# EAGLE schematic main_circuit (EAGLE 7.5.0)

## Sheet 1 of 3
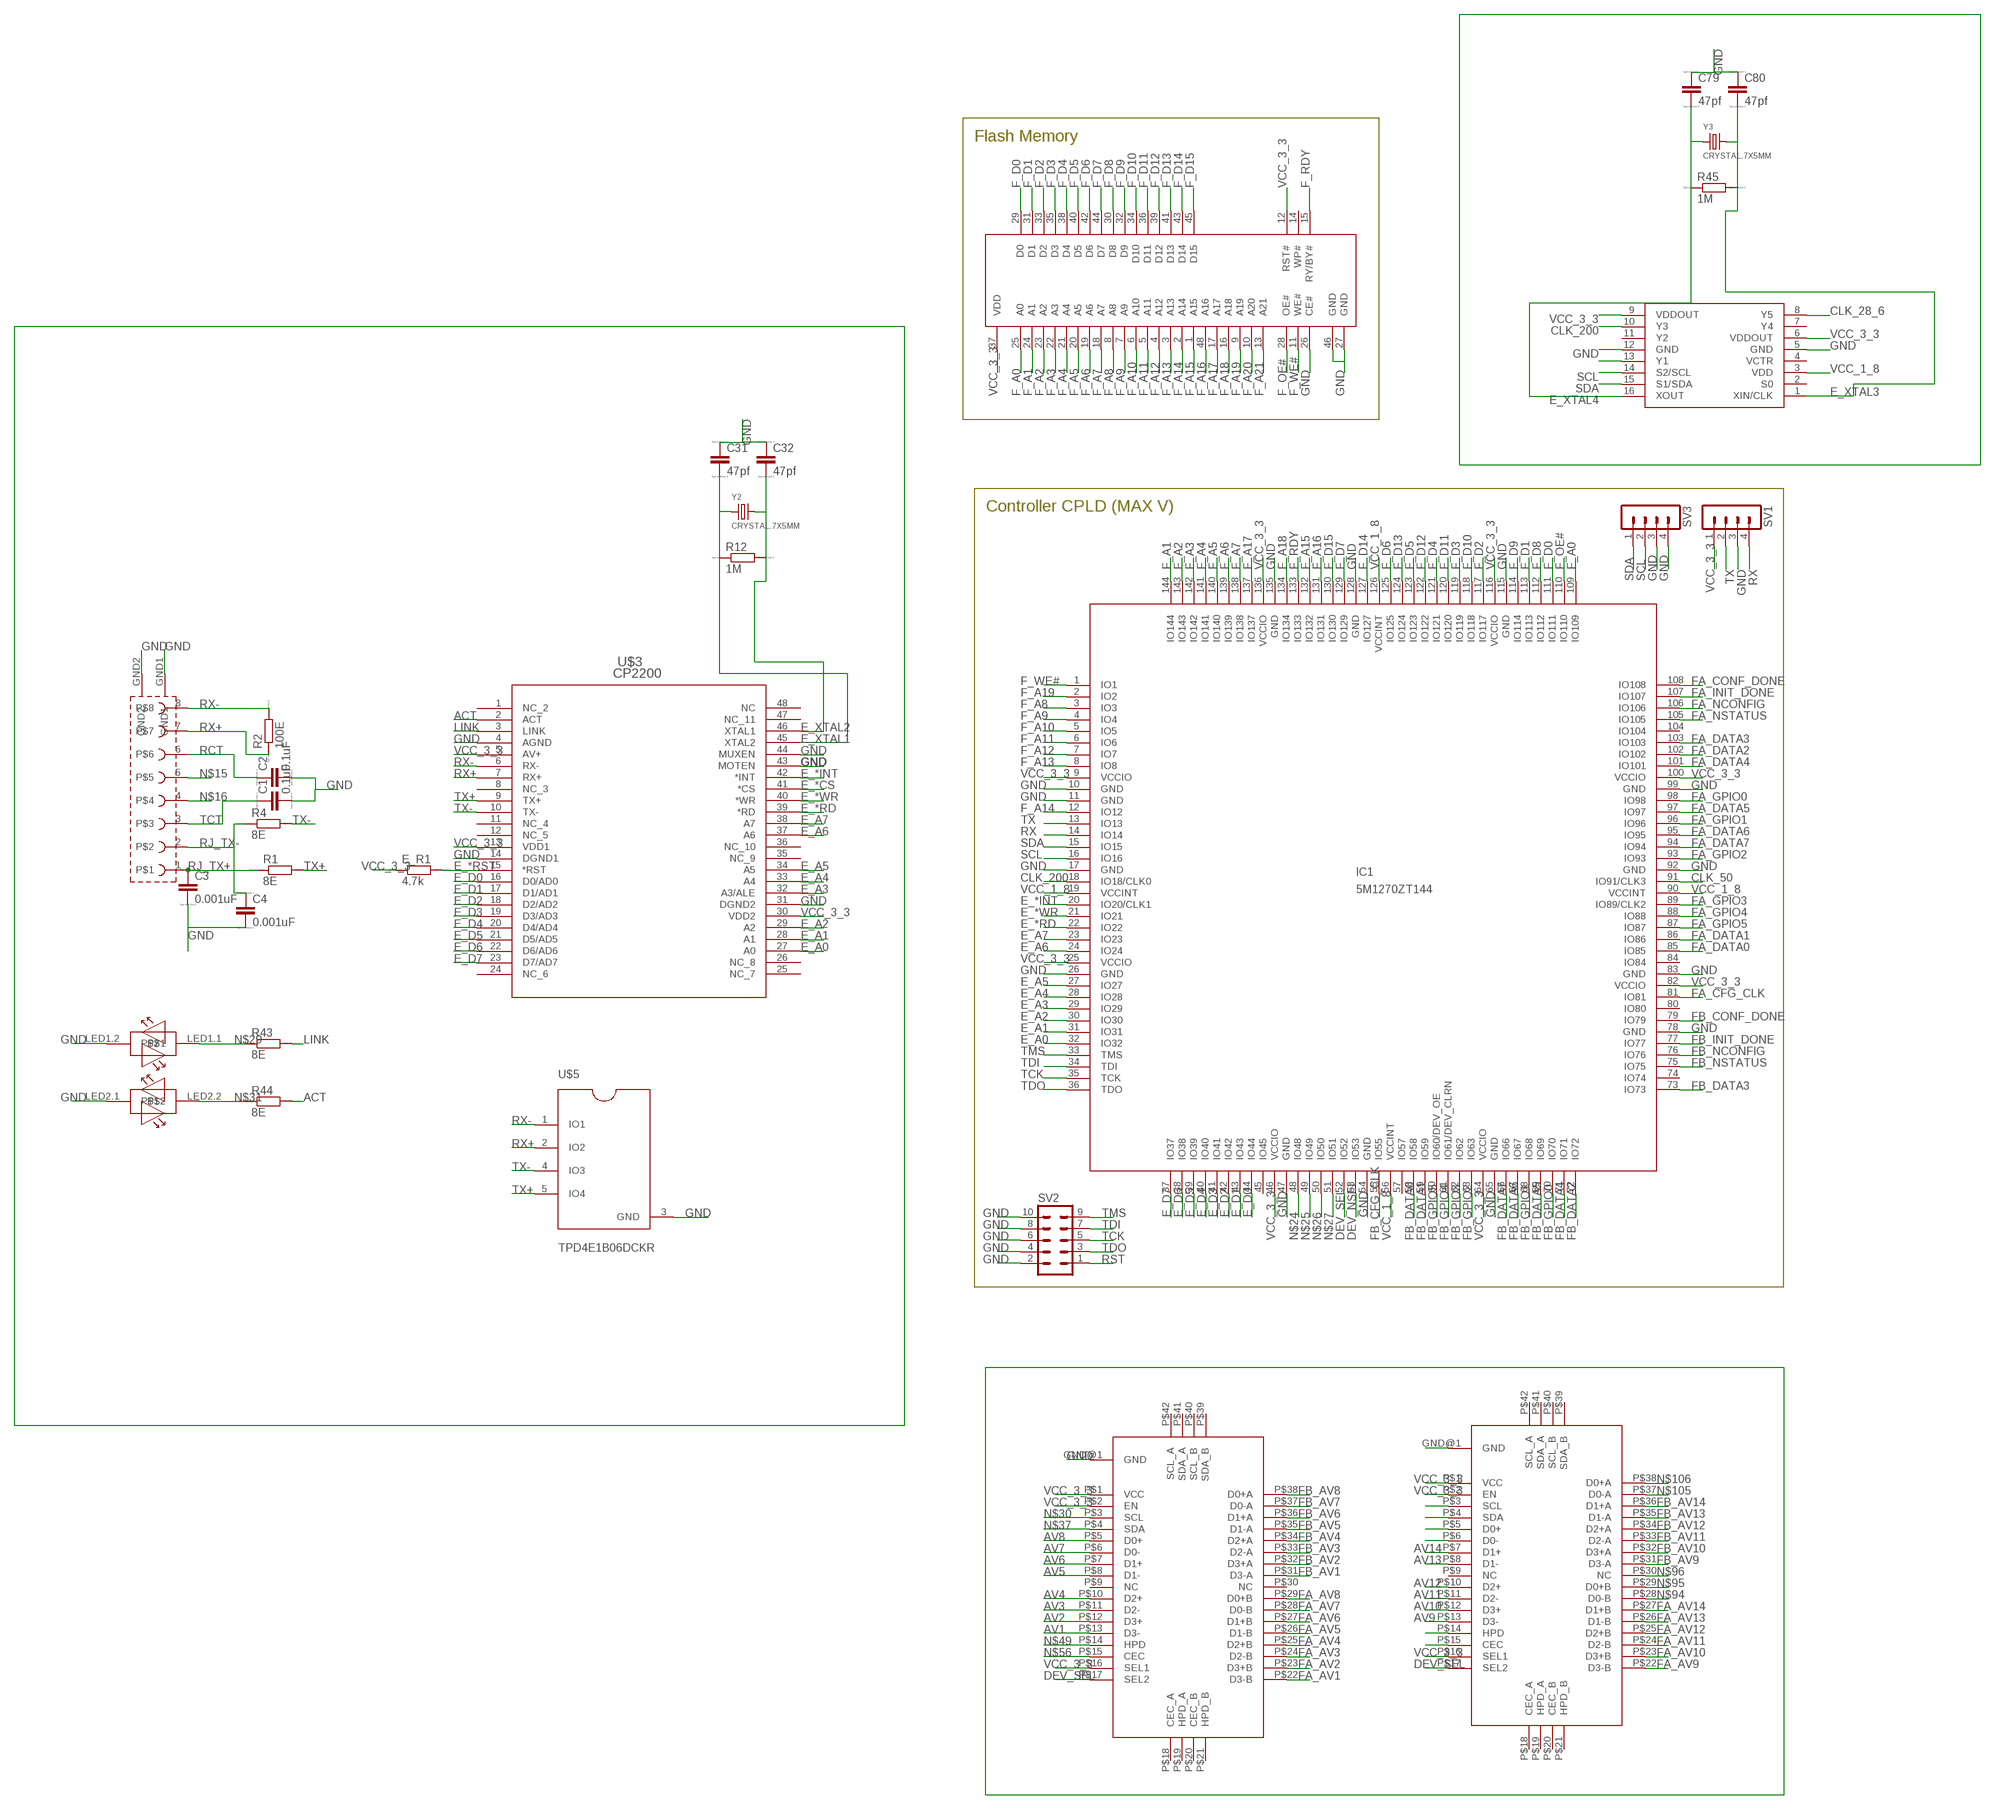
[diagram p0: schematic, sheet 1, part 1 of 3]
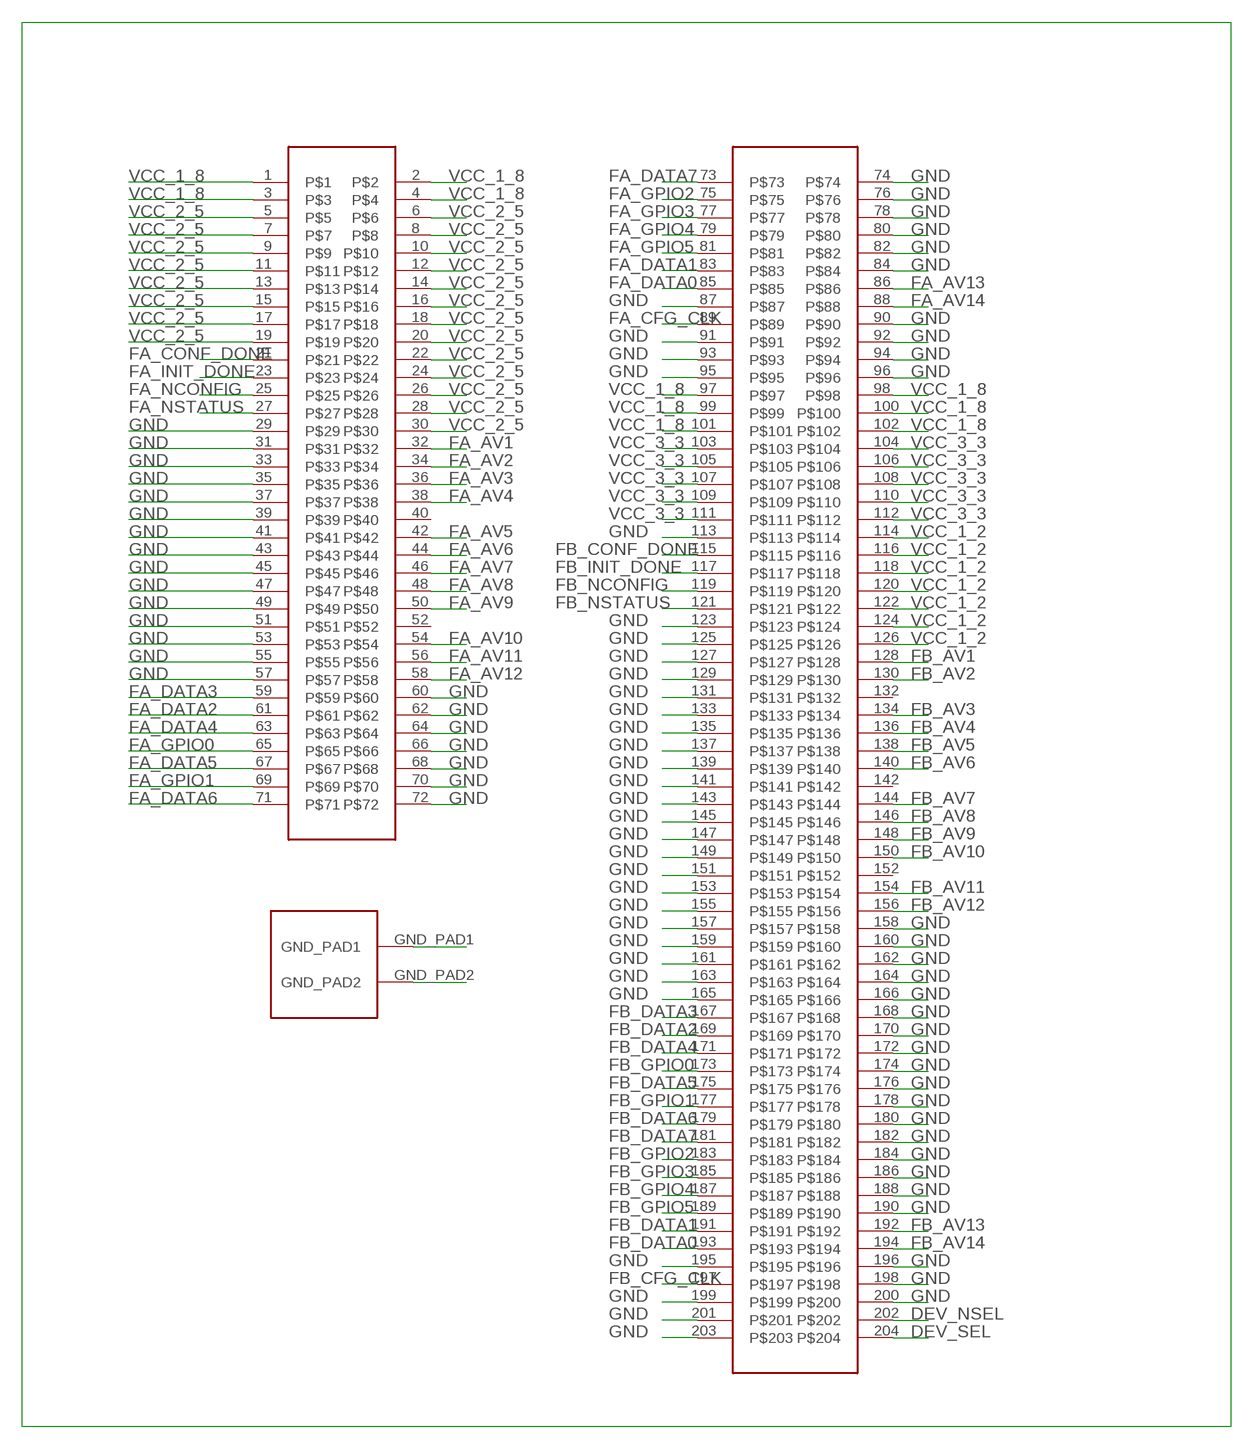
[diagram p1: schematic, sheet 1, part 2 of 3]
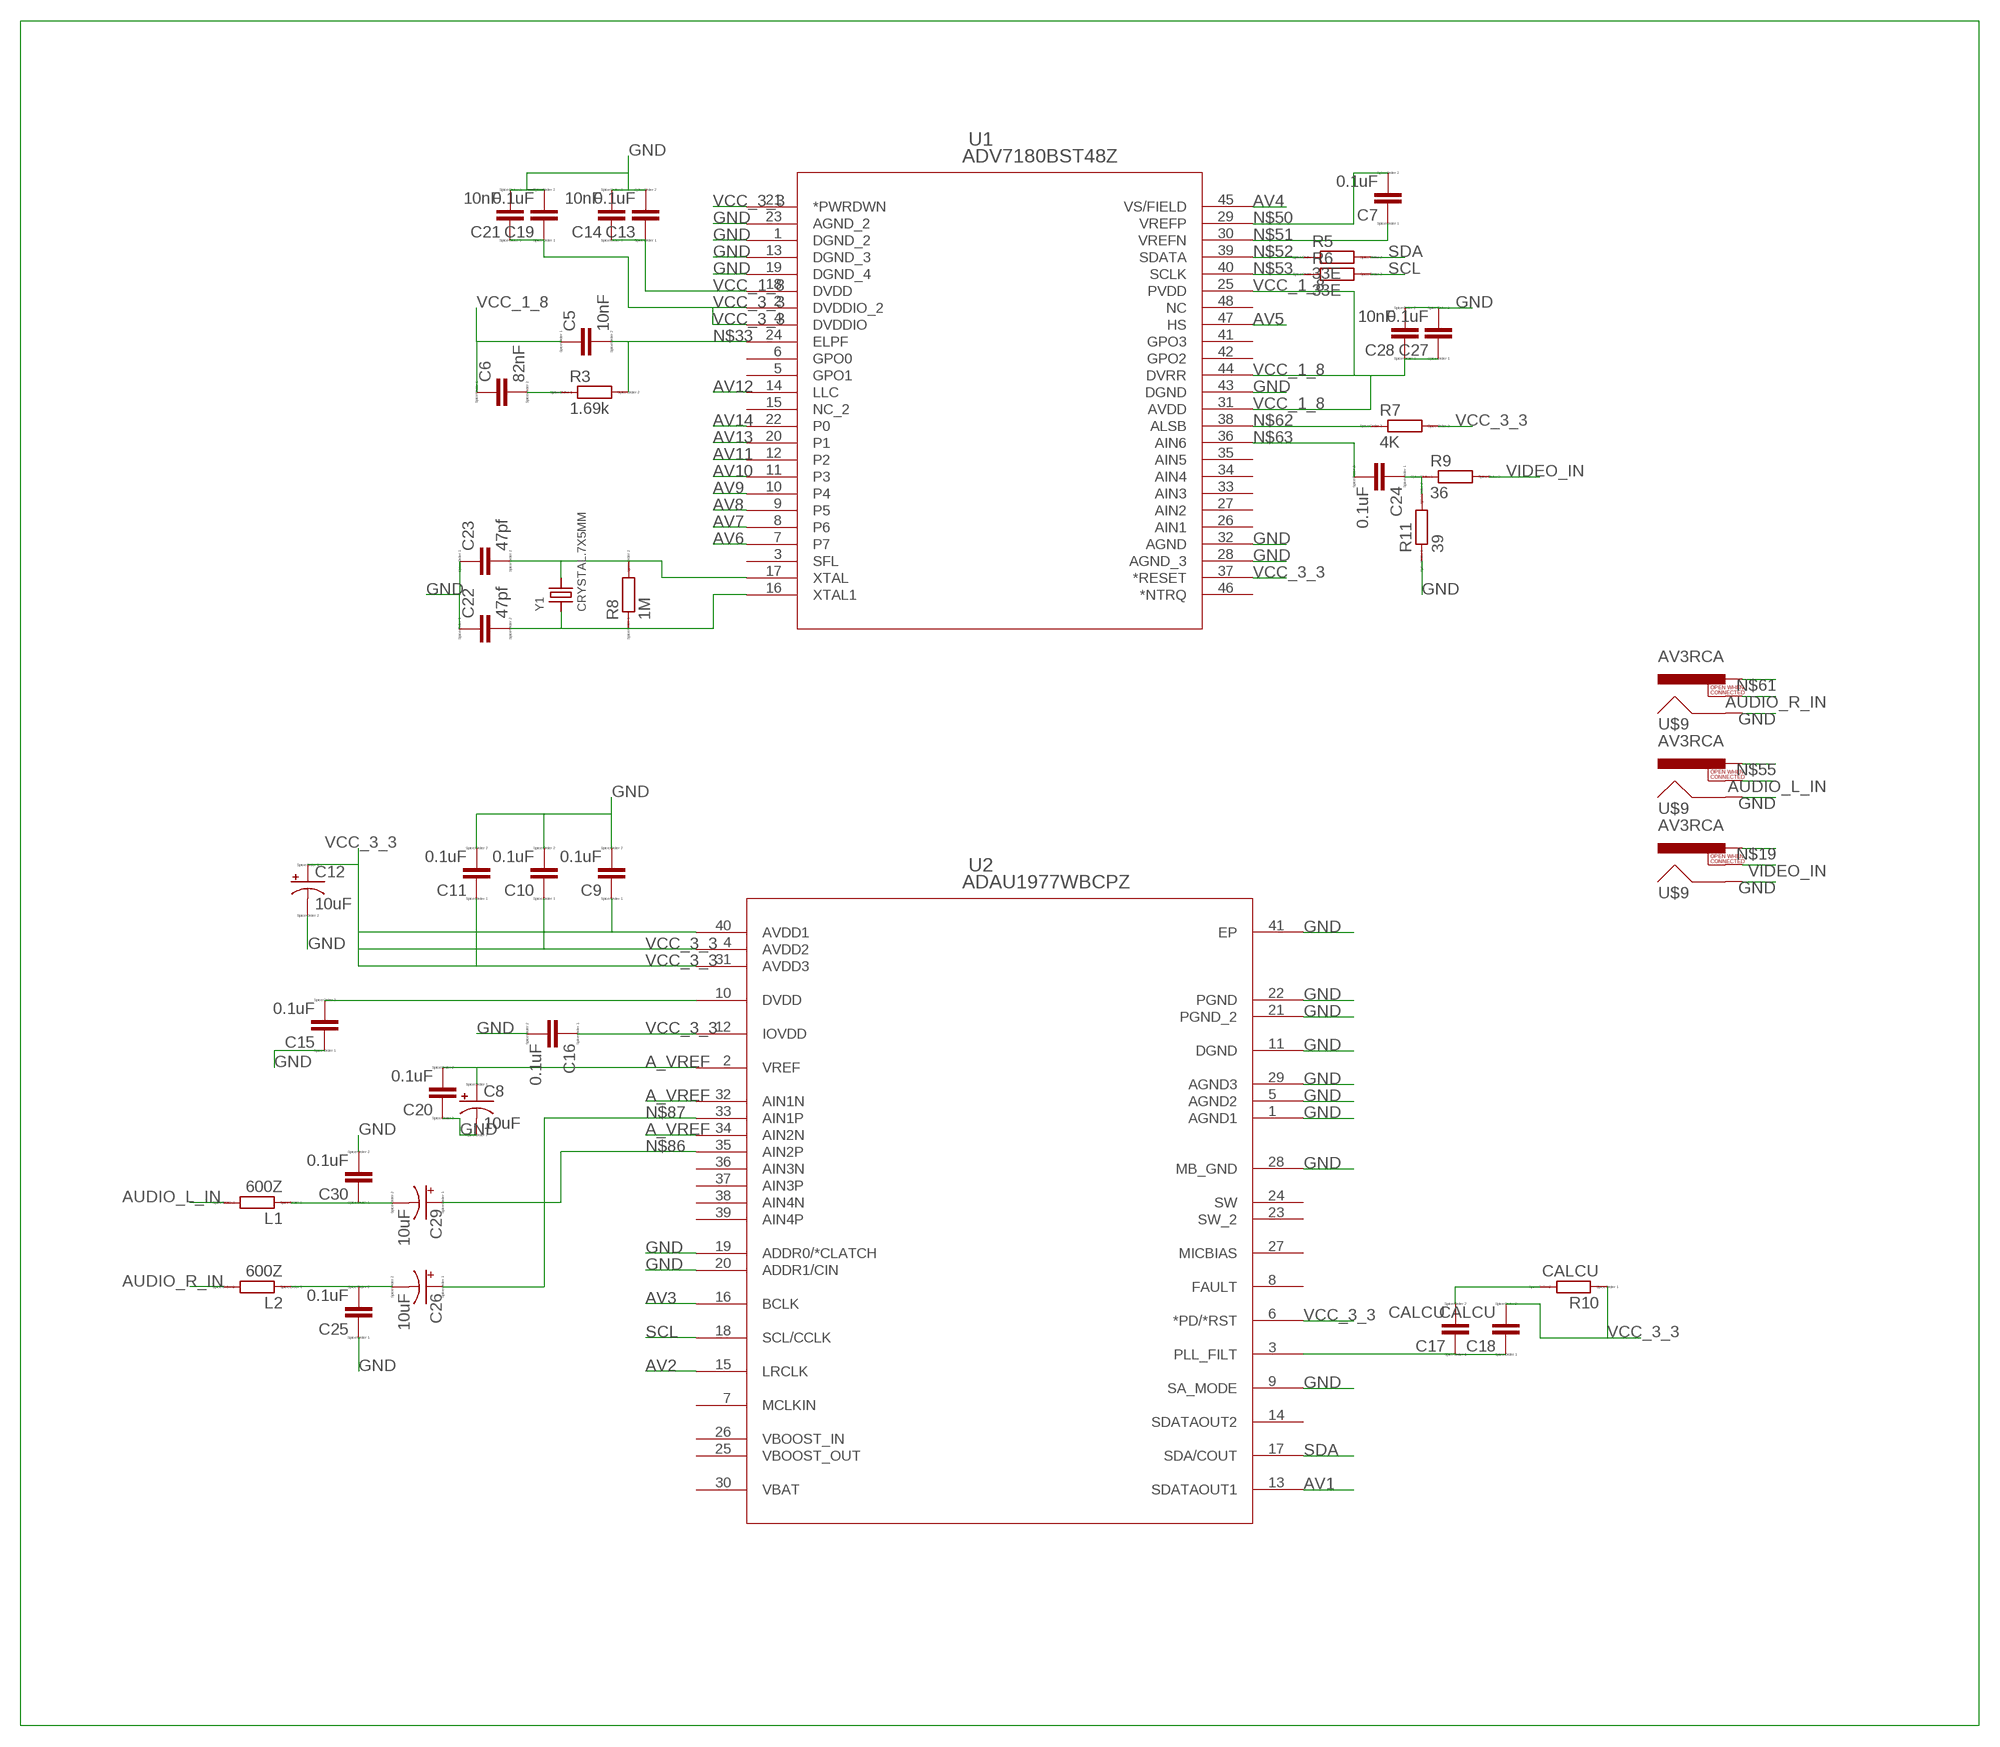
[diagram p2: schematic, sheet 1, part 3 of 3]

### Parts
C1  0.1uF  CC0402  [C0402]
C2  0.1uF  CC0402  [C0402]
C3  0.001uF  CC0402  [C0402]
C4  0.001uF  CC0402  [C0402]
C5  10nF  CC0603  [C0603]
C6  82nF  CC0603  [C0603]
C7  0.1uF  CC0603  [C0603]
C8  10uF  CPOL-USE2,5-6E  [E2,5-6E]
C9  0.1uF  CC0603  [C0603]
C10  0.1uF  CC0603  [C0603]
C11  0.1uF  CC0603  [C0603]
C12  10uF  CPOL-USE2,5-6E  [E2,5-6E]
C13  0.1uF  CC0603  [C0603]
C14  10nF  CC0603  [C0603]
C15  0.1uF  CC0603  [C0603]
C16  0.1uF  CC0603  [C0603]
C17  CALCU  CC0603  [C0603]
C18  CALCU  CC0603  [C0603]
C19  0.1uF  CC0603  [C0603]
C20  0.1uF  CC0603  [C0603]
C21  10nF  CC0603  [C0603]
C22  47pf  CC0603  [C0603]
C23  47pf  CC0603  [C0603]
C24  0.1uF  CC0603  [C0603]
C25  0.1uF  CC0603  [C0603]
C26  10uF  CPOL-USE2,5-6E  [E2,5-6E]
C27  0.1uF  CC0603  [C0603]
C28  10nF  CC0603  [C0603]
C29  10uF  CPOL-USE2,5-6E  [E2,5-6E]
C30  0.1uF  CC0603  [C0603]
C31  47pf  CC0603  [C0603]
C32  47pf  CC0603  [C0603]
C79  47pf  CC0603  [C0603]
C80  47pf  CC0603  [C0603]
E_R1  4.7k  RR0603  [R0603]
GND  TS3DV642  [R-PWQFN-N42]
IC1  5M1270ZT144  [TQFP144]
L1  600Z  RR0603  [R0603]
L2  600Z  RR0603  [R0603]
R1  8E  RR0402  [R0402]
R2  100E  RR0402  [R0402]
R3  1.69k  RR0603  [R0603]
R4  8E  RR0402  [R0402]
R5  33E  RR0603  [R0603]
R6  33E  RR0603  [R0603]
R7  4K  RR0603  [R0603]
R8  1M  RR0603  [R0603]
R9  36  RR0603  [R0603]
R10  CALCU  RR0603  [R0603]
R11  39  RR0603  [R0603]
R12  1M  RR0603  [R0603]
R43  8E  RR0402  [R0402]
R44  8E  RR0402  [R0402]
R45  1M  RR0603  [R0603]
SV1  MA04-1  [MA04-1]
SV2  MA05-2  [MA05-2]
SV3  MA04-1  [MA04-1]
U1  ADV7180BST48Z  [ST_48]
U2  ADAU1977WBCPZ  [CP_40_14]
U$1  SST39VF64  [TSOP48]
U$2  CDCE925  [R-PDSO-G16]
U$3  CP2200  CP2200-GQ  [QFP48-7X7-0P5MM]
U$4  SODIMM  [SODIMM_DDR3_CONN]
U$5  TPD4E1B06DCKR  [SC70-6]
U$6  MAGJACK  [MAGJACK]
U$8  TS3DV642  [R-PWQFN-N42]
U$9  AV3RCA  [AV3RCA]
Y1  CRYSTAL.7X5MM  [7X5MM]
Y2  CRYSTAL.7X5MM  [7X5MM]
Y3  CRYSTAL.7X5MM  [7X5MM]

### Nets
A_VREF: C8.+ C20.2 U2.2(VREF) U2.32(AIN1N) U2.34(AIN2N)
ACT: R44.2 U$3.2(ACT)
AUDIO_L_IN: L1.2 U$9.SWITCH
AUDIO_R_IN: L2.2 U$9.SWITCH1
AV1: GND.P$13(D3-) U2.13(SDATAOUT1)
AV2: GND.P$12(D3+) U2.15(LRCLK)
AV3: GND.P$11(D2-) U2.16(BCLK)
AV4: GND.P$10(D2+) U1.45(VS/FIELD)
AV5: GND.P$8(D1-) U1.47(HS)
AV6: GND.P$7(D1+) U1.7
AV7: GND.P$6(D0-) U1.8(P6)
AV8: GND.P$5(D0+) U1.9(P5)
AV9: U1.10(P4) U$8.P$13(D3-)
AV10: U1.11(P3) U$8.P$12(D3+)
AV11: U1.12(P2) U$8.P$11(D2-)
AV12: U1.14(LLC) U$8.P$10(D2+)
AV13: U1.20(P1) U$8.P$8(D1-)
AV14: U1.22(P0) U$8.P$7(D1+)
CLK_28_6: U$2.8(Y5)
CLK_50: IC1.91(IO91/CLK3) U$2.13(Y1)
CLK_200: IC1.18(IO18/CLK0) U$2.10(Y3)
DEV_NSEL: IC1.53(IO53) U$4.202
DEV_SEL: GND.P$17(SEL2) IC1.52(IO52) U$4.204 U$8.P$17(SEL2)
E_*CS: U$3.41(*CS)
E_*INT: IC1.20(IO20/CLK1) U$3.42(*INT)
E_*RD: IC1.22(IO22) U$3.39(*RD)
E_*RST: E_R1.2 U$3.15(*RST)
E_*WR: IC1.21(IO21) U$3.40(*WR)
E_A0: IC1.32(IO32) U$3.27(A0)
E_A1: IC1.31(IO31) U$3.28(A1)
E_A2: IC1.30(IO30) U$3.29(A2)
E_A3: IC1.29(IO29) U$3.32(A3/ALE)
E_A4: IC1.28(IO28) U$3.33(A4)
E_A5: IC1.27(IO27) U$3.34(A5)
E_A6: IC1.24(IO24) U$3.37(A6)
E_A7: IC1.23(IO23) U$3.38(A7)
E_D0: IC1.44(IO44) U$3.16(D0/AD0)
E_D1: IC1.43(IO43) U$3.17(D1/AD1)
E_D2: IC1.42(IO42) U$3.18(D2/AD2)
E_D3: IC1.41(IO41) U$3.19(D3/AD3)
E_D4: IC1.40(IO40) U$3.20(D4/AD4)
E_D5: IC1.39(IO39) U$3.21(D5/AD5)
E_D6: IC1.38(IO38) U$3.22(D6/AD6)
E_D7: IC1.37(IO37) U$3.23(D7/AD7)
E_XTAL1: C31.2 R12.1 U$3.45(XTAL2) Y2.1
E_XTAL2: C32.2 R12.2 U$3.46(XTAL1) Y2.3
E_XTAL3: C80.2 R45.2 U$2.1(XIN/CLK) Y3.3
E_XTAL4: C79.2 R45.1 U$2.16(XOUT) Y3.1
F_A0: IC1.109(IO109) U$1.25(A0)
F_A1: IC1.144(IO144) U$1.24(A1)
F_A2: IC1.143(IO143) U$1.23(A2)
F_A3: IC1.142(IO142) U$1.22(A3)
F_A4: IC1.141(IO141) U$1.21(A4)
F_A5: IC1.140(IO140) U$1.20(A5)
F_A6: IC1.139(IO139) U$1.19(A6)
F_A7: IC1.138(IO138) U$1.18(A7)
F_A8: IC1.3(IO3) U$1.8(A8)
F_A9: IC1.4(IO4) U$1.7(A9)
F_A10: IC1.5(IO5) U$1.6(A10)
F_A11: IC1.6(IO6) U$1.5(A11)
F_A12: IC1.7(IO7) U$1.4(A12)
F_A13: IC1.8(IO8) U$1.3(A13)
F_A14: IC1.12(IO12) U$1.2(A14)
F_A15: IC1.132(IO132) U$1.1(A15)
F_A16: IC1.131(IO131) U$1.48(A16)
F_A17: IC1.137(IO137) U$1.17(A17)
F_A18: IC1.134(IO134) U$1.16(A18)
F_A19: IC1.2(IO2) U$1.9(A19)
F_A20: U$1.10(A20)
F_A21: U$1.13(A21)
F_D0: IC1.111(IO111) U$1.29(D0)
F_D1: IC1.113(IO113) U$1.31(D1)
F_D2: IC1.117(IO117) U$1.33(D2)
F_D3: IC1.119(IO119) U$1.35(D3)
F_D4: IC1.121(IO121) U$1.38(D4)
F_D5: IC1.123(IO123) U$1.40(D5)
F_D6: IC1.125(IO125) U$1.42(D6)
F_D7: IC1.129(IO129) U$1.44(D7)
F_D8: IC1.112(IO112) U$1.30(D8)
F_D9: IC1.114(IO114) U$1.32(D9)
F_D10: IC1.118(IO118) U$1.34(D10)
F_D11: IC1.120(IO120) U$1.36(D11)
F_D12: IC1.122(IO122) U$1.39(D12)
F_D13: IC1.124(IO124) U$1.41(D13)
F_D14: IC1.127(IO127) U$1.43(D14)
F_D15: IC1.130(IO130) U$1.45(D15)
F_OE#: IC1.110(IO110) U$1.28(OE#)
F_RDY: IC1.133(IO133) U$1.15(RY/BY#)
F_WE#: IC1.1(IO1) U$1.11(WE#)
FA_AV1: GND.P$22(D3-B) U$4.32
FA_AV2: GND.P$23(D3+B) U$4.34
FA_AV3: GND.P$24(D2-B) U$4.36
FA_AV4: GND.P$25(D2+B) U$4.38
FA_AV5: GND.P$26(D1-B) U$4.42
FA_AV6: GND.P$27(D1+B) U$4.44
FA_AV7: GND.P$28(D0-B) U$4.46
FA_AV8: GND.P$29(D0+B) U$4.48
FA_AV9: U$4.50 U$8.P$22(D3-B)
FA_AV10: U$4.54 U$8.P$23(D3+B)
FA_AV11: U$4.56 U$8.P$24(D2-B)
FA_AV12: U$4.58 U$8.P$25(D2+B)
FA_AV13: U$4.86 U$8.P$26(D1-B)
FA_AV14: U$4.88 U$8.P$27(D1+B)
FA_CFG_CLK: IC1.81(IO81) U$4.89
FA_CONF_DONE: IC1.108(IO108) U$4.21
FA_DATA0: IC1.85(IO85) U$4.85
FA_DATA1: IC1.86(IO86) U$4.83
FA_DATA2: IC1.102(IO102) U$4.61
FA_DATA3: IC1.103(IO103) U$4.59
FA_DATA4: IC1.101(IO101) U$4.63
FA_DATA5: IC1.97(IO97) U$4.67
FA_DATA6: IC1.95(IO95) U$4.71
FA_DATA7: IC1.94(IO94) U$4.73
FA_GPIO0: IC1.98(IO98) U$4.65
FA_GPIO1: IC1.96(IO96) U$4.69
FA_GPIO2: IC1.93(IO93) U$4.75
FA_GPIO3: IC1.89(IO89/CLK2) U$4.77
FA_GPIO4: IC1.88(IO88) U$4.79
FA_GPIO5: IC1.87(IO87) U$4.81
FA_INIT_DONE: IC1.107(IO107) U$4.23
FA_NCONFIG: IC1.106(IO106) U$4.25
FA_NSTATUS: IC1.105(IO105) U$4.27
FB_AV1: GND.P$31(D3-A) U$4.128
FB_AV2: GND.P$32(D3+A) U$4.130
FB_AV3: GND.P$33(D2-A) U$4.134
FB_AV4: GND.P$34(D2+A) U$4.136
FB_AV5: GND.P$35(D1-A) U$4.138
FB_AV6: GND.P$36(D1+A) U$4.140
FB_AV7: GND.P$37(D0-A) U$4.144
FB_AV8: GND.P$38(D0+A) U$4.146
FB_AV9: U$4.148 U$8.P$31(D3-A)
FB_AV10: U$4.150 U$8.P$32(D3+A)
FB_AV11: U$4.154 U$8.P$33(D2-A)
FB_AV12: U$4.156 U$8.P$34(D2+A)
FB_AV13: U$4.192 U$8.P$35(D1-A)
FB_AV14: U$4.194 U$8.P$36(D1+A)
FB_CFG_CLK: IC1.55(IO55) U$4.197
FB_CONF_DONE: IC1.79(IO79) U$4.115
FB_DATA0: IC1.58(IO58) U$4.193
FB_DATA1: IC1.59(IO59) U$4.191
FB_DATA2: IC1.72(IO72) U$4.169
FB_DATA3: IC1.73(IO73) U$4.167
FB_DATA4: IC1.71(IO71) U$4.171
FB_DATA5: IC1.69(IO69) U$4.175
FB_DATA6: IC1.67(IO67) U$4.179
FB_DATA7: IC1.66(IO66) U$4.181
FB_GPIO0: IC1.70(IO70) U$4.173
FB_GPIO1: IC1.68(IO68) U$4.177
FB_GPIO2: IC1.63(IO63) U$4.183
FB_GPIO3: IC1.62(IO62) U$4.185
FB_GPIO4: IC1.61(IO61/DEV_CLRN) U$4.187
FB_GPIO5: IC1.60(IO60/DEV_OE) U$4.189
FB_INIT_DONE: IC1.77(IO77) U$4.117
FB_NCONFIG: IC1.76(IO76) U$4.119
FB_NSTATUS: IC1.75(IO75) U$4.121
GND: C1.2 C2.2 C3.2 C4.2 C8.- C9.2 C10.2 C11.2 C12.- C13.2 C14.2 C15.1 C16.2 C19.2 C20.1 C21.2 C22.1 C23.1 C25.1 C27.2 C28.2 C30.2 C31.1 C32.1 C79.1 C80.1 GND.GND@1(GND) IC1.10(GND) IC1.11(GND) IC1.17(GND) IC1.26(GND) IC1.47(GND) IC1.54(GND) IC1.65(GND) IC1.78(GND) IC1.83(GND) IC1.92(GND) IC1.99(GND) IC1.115(GND) IC1.128(GND) IC1.135(GND) R11.1 SV1.3 SV2.2 SV2.4 SV2.6 SV2.8 SV2.10 SV3.3 SV3.4 U1.1(DGND_2) U1.13(DGND_3) U1.19(DGND_4) U1.23(AGND_2) U1.28(AGND_3) U1.32(AGND) U1.43(DGND) U2.1(AGND1) U2.5(AGND2) U2.9(SA_MODE) U2.11(DGND) U2.19(ADDR0/*CLATCH) U2.20(ADDR1/CIN) U2.21(PGND_2) U2.22(PGND) U2.28(MB_GND) U2.29(AGND3) U2.41(EP) U$1.26(CE#) U$1.27(GND) U$1.46(GND) U$2.5(GND) U$2.12(GND) U$3.4(AGND) U$3.14(DGND1) U$3.31(DGND2) U$3.43(MOTEN) U$3.44(MUXEN) U$4.29 U$4.31 U$4.33 U$4.35 U$4.37 U$4.39 U$4.41 U$4.43 U$4.45 U$4.47 U$4.49 U$4.51 U$4.53 U$4.55 U$4.57 U$4.60 U$4.62 U$4.64 U$4.66 U$4.68 U$4.70 U$4.72 U$4.74 U$4.76 U$4.78 U$4.80 U$4.82 U$4.84 U$4.87 U$4.90 U$4.91 U$4.92 U$4.93 U$4.94 U$4.95 U$4.96 U$4.113 U$4.123 U$4.125 U$4.127 U$4.129 U$4.131 U$4.133 U$4.135 U$4.137 U$4.139 U$4.141 U$4.143 U$4.145 U$4.147 U$4.149 U$4.151 U$4.153 U$4.155 U$4.157 U$4.158 U$4.159 U$4.160 U$4.161 U$4.162 U$4.163 U$4.164 U$4.165 U$4.166 U$4.168 U$4.170 U$4.172 U$4.174 U$4.176 U$4.178 U$4.180 U$4.182 U$4.184 U$4.186 U$4.188 U$4.190 U$4.195 U$4.196 U$4.198 U$4.199 U$4.200 U$4.201 U$4.203 U$4.GND_PAD1 U$4.GND_PAD2 U$5.3(GND) U$6.GND1 U$6.GND2 U$6.LED1.2 U$6.LED2.1 U$8.GND@1(GND) U$9.SHELL U$9.SHELL1 U$9.SHELL2 ; also sheet 2,3
LINK: R43.2 U$3.3(LINK)
N$9: C29.- C30.1 L1.1
N$12: C6.2 R3.1
N$14: C15.2 U2.10(DVDD)
N$15: U$6.5
N$16: U$6.4
N$18: C25.2 C26.- L2.1
N$19: U$9.PIN2
N$20: C24.1 R9.1 R11.2
N$24: IC1.48(IO48)
N$25: IC1.49(IO49)
N$26: IC1.50(IO50)
N$27: IC1.51(IO51)
N$29: R43.1 U$6.LED1.1
N$30: GND.P$3(SCL)
N$31: R44.1 U$6.LED2.2
N$33: C5.2 R3.2 U1.24(ELPF)
N$34: C17.2 R10.2
N$36: C17.1 C18.1 U2.3(PLL_FILT)
N$37: GND.P$4(SDA)
N$47: C23.2 R8.2 U1.17(XTAL) Y1.3
N$48: C22.2 R8.1 U1.16(XTAL1) Y1.1
N$49: GND.P$14(HPD)
N$50: C7.2 U1.29(VREFP)
N$51: C7.1 U1.30(VREFN)
N$52: R5.1 U1.39(SDATA)
N$53: R6.1 U1.40(SCLK)
N$55: U$9.PIN
N$56: GND.P$15(CEC)
N$61: U$9.PIN1
N$62: R7.1 U1.38(ALSB)
N$63: C24.2 U1.36(AIN6)
N$69: U$8.P$3(SCL)
N$70: U$8.P$4(SDA)
N$71: U$8.P$5(D0+)
N$72: U$8.P$6(D0-)
N$86: C29.+ U2.35(AIN2P)
N$87: C26.+ U2.33(AIN1P)
N$94: U$8.P$28(D0-B)
N$95: U$8.P$29(D0+B)
N$96: U$8.P$30(NC)
N$105: U$8.P$37(D0-A)
N$106: U$8.P$38(D0+A)
N$117: U$8.P$14(HPD)
N$118: U$8.P$15(CEC)
RCT: C2.1 U$6.6
RJ_TX+: C3.1 R1.1 U$6.1
RJ_TX-: C4.1 R4.1 U$6.2
RST: SV2.1
RX: IC1.14(IO14) SV1.4
RX+: R2.1 U$3.7(RX+) U$5.2(IO2) U$6.7
RX-: R2.2 U$3.6(RX-) U$5.1(IO1) U$6.8
SCL: IC1.16(IO16) R6.2 SV3.2 U2.18(SCL/CCLK) U$2.14(S2/SCL) ; also sheet 2
SDA: IC1.15(IO15) R5.2 SV3.1 U2.17(SDA/COUT) U$2.15(S1/SDA) ; also sheet 2
TCK: IC1.35(TCK) SV2.5 ; also sheet 3
TCT: C1.1 U$6.3
TDI: IC1.34(TDI) SV2.7 ; also sheet 3
TDO: IC1.36(TDO) SV2.3 ; also sheet 3
TMS: IC1.33(TMS) SV2.9 ; also sheet 3
TX: IC1.13(IO13) SV1.2
TX+: R1.2 U$3.9(TX+) U$5.5(IO4)
TX-: R4.2 U$3.10(TX-) U$5.4(IO3)
VCC_1_2: U$4.114 U$4.116 U$4.118 U$4.120 U$4.122 U$4.124 U$4.126 ; also sheet 2
VCC_1_8: C5.1 C6.1 C13.1 C14.1 C27.1 C28.1 IC1.19(VCCINT) IC1.56(VCCINT) IC1.90(VCCINT) IC1.126(VCCINT) U1.18(DVDD) U1.25(PVDD) U1.31(AVDD) U1.44(DVRR) U$2.3(VDD) U$4.1 U$4.2 U$4.3 U$4.4 U$4.97 U$4.98 U$4.99 U$4.100 U$4.101 U$4.102 ; also sheet 2,3
VCC_2_5: U$4.5 U$4.6 U$4.7 U$4.8 U$4.9 U$4.10 U$4.11 U$4.12 U$4.13 U$4.14 U$4.15 U$4.16 U$4.17 U$4.18 U$4.19 U$4.20 U$4.22 U$4.24 U$4.26 U$4.28 U$4.30 ; also sheet 2
VCC_3_3: C9.1 C10.1 C11.1 C12.+ C16.1 C18.2 C19.1 C21.1 E_R1.1 GND.P$1(VCC) GND.P$2(EN) GND.P$16(SEL1) IC1.9(VCCIO) IC1.25(VCCIO) IC1.46(VCCIO) IC1.64(VCCIO) IC1.82(VCCIO) IC1.100(VCCIO) IC1.116(VCCIO) IC1.136(VCCIO) R7.2 R10.1 SV1.1 U1.2(DVDDIO_2) U1.4(DVDDIO) U1.21(*PWRDWN) U1.37(*RESET) U2.4(AVDD2) U2.6(*PD/*RST) U2.12(IOVDD) U2.31(AVDD3) U2.40(AVDD1) U$1.12(RST#) U$1.37(VDD) U$2.6(VDDOUT) U$2.9(VDDOUT) U$3.5(AV+) U$3.13(VDD1) U$3.30(VDD2) U$4.103 U$4.104 U$4.105 U$4.106 U$4.107 U$4.108 U$4.109 U$4.110 U$4.111 U$4.112 U$8.P$1(VCC) U$8.P$2(EN) U$8.P$16(SEL1) ; also sheet 2,3
VIDEO_IN: R9.2 U$9.SWITCH2
Unconnected: GND.P$9(NC) GND.P$18(CEC_A) GND.P$19(HPD_A) GND.P$20(CEC_B) GND.P$21(HPD_B) GND.P$30(NC) GND.P$39(SDA_B) GND.P$40(SCL_B) GND.P$41(SDA_A) GND.P$42(SCL_A) IC1.45(IO45) IC1.57(IO57) IC1.74(IO74) IC1.80(IO80) IC1.84(IO84) U1.3(SFL) U1.5(GPO1) U1.6(GPO0) U1.15(NC_2) U1.26(AIN1) U1.27(AIN2) U1.33(AIN3) U1.34(AIN4) U1.35(AIN5) U1.41(GPO3) U1.42(GPO2) U1.46(*NTRQ) U1.48(NC) U2.7(MCLKIN) U2.8(FAULT) U2.14(SDATAOUT2) U2.23(SW_2) U2.24(SW) U2.25(VBOOST_OUT) U2.26(VBOOST_IN) U2.27(MICBIAS) U2.30(VBAT) U2.36(AIN3N) U2.37(AIN3P) U2.38(AIN4N) U2.39(AIN4P) U$1.14(WP#) U$2.2(S0) U$2.4(VCTR) U$2.7(Y4) U$2.11(Y2) U$3.1(NC_2) U$3.8(NC_3) U$3.11(NC_4) U$3.12(NC_5) U$3.24(NC_6) U$3.25(NC_7) U$3.26(NC_8) U$3.35(NC_9) U$3.36(NC_10) U$3.47(NC_11) U$3.48(NC) U$4.40 U$4.52 U$4.132 U$4.142 U$4.152 U$8.P$9(NC) U$8.P$18(CEC_A) U$8.P$19(HPD_A) U$8.P$20(CEC_B) U$8.P$21(HPD_B) U$8.P$39(SDA_B) U$8.P$40(SCL_B) U$8.P$41(SDA_A) U$8.P$42(SCL_A)

### Notes on the sheet
- Flash Memory
- Controller CPLD (MAX V)

## Sheet 2 of 3
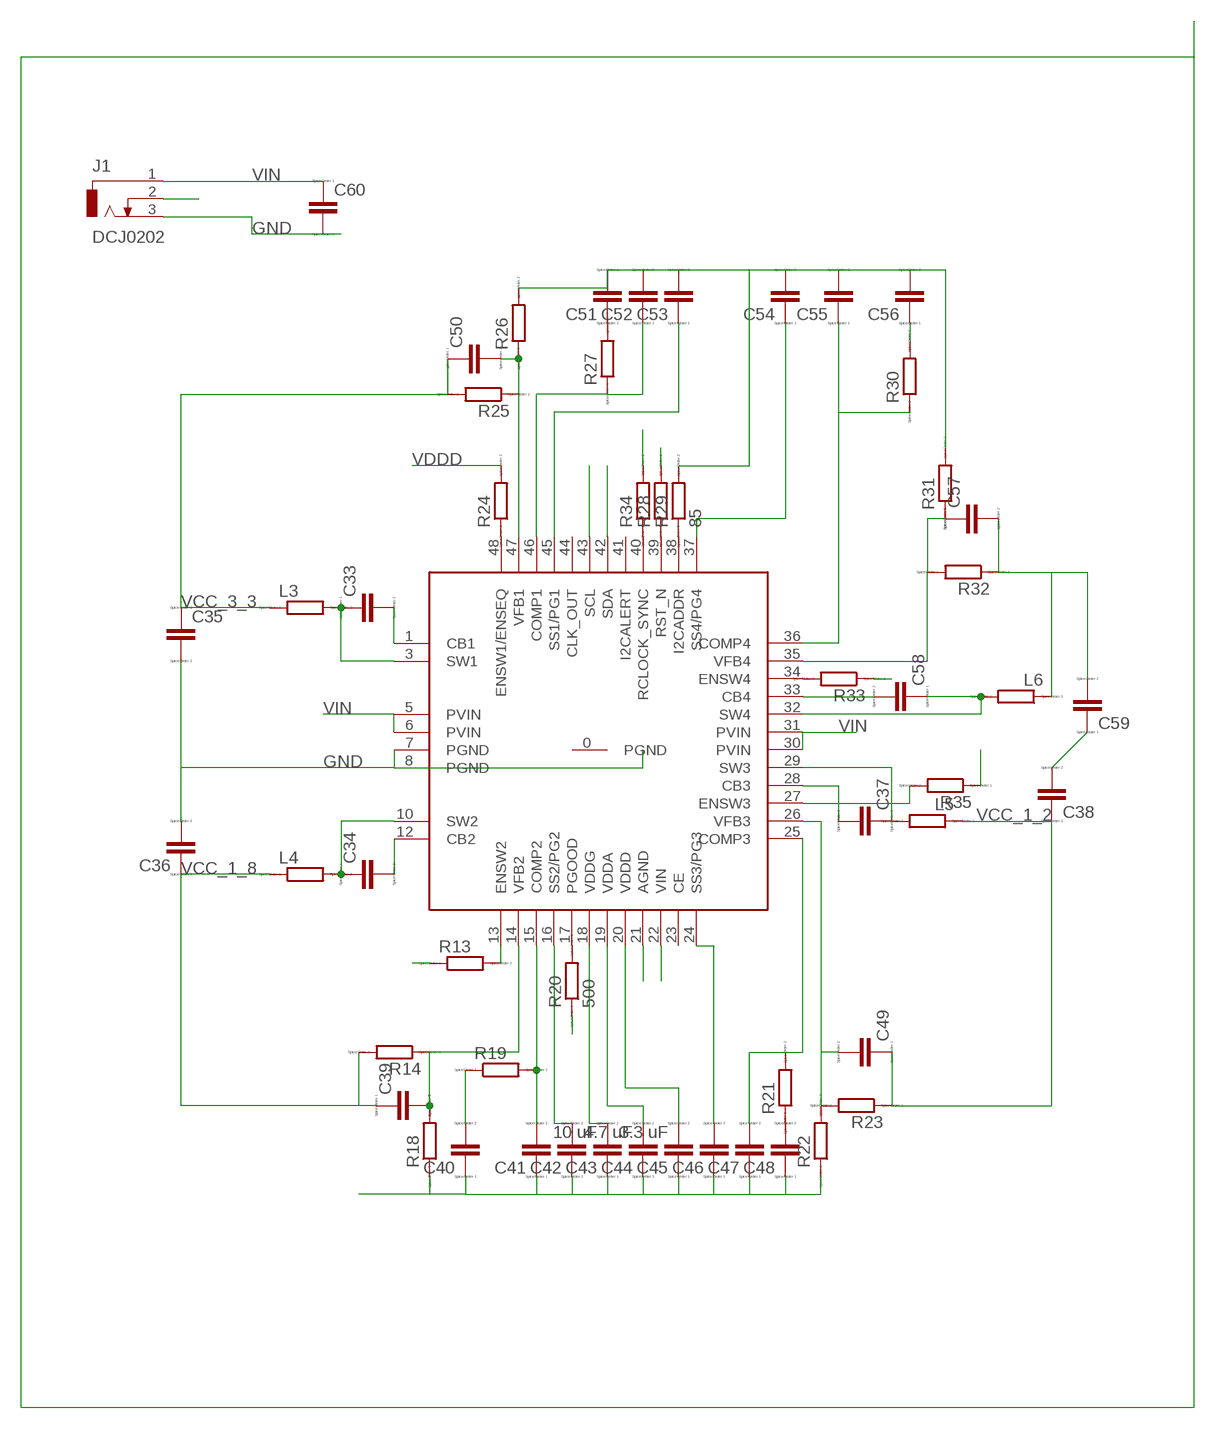
[diagram p3: schematic, sheet 2]

### Parts
C33  CC0603  [C0603]
C34  CC0603  [C0603]
C35  CC0603  [C0603]
C36  CC0603  [C0603]
C37  CC0603  [C0603]
C38  CC0603  [C0603]
C39  CC0603  [C0603]
C40  CC0603  [C0603]
C41  CC0603  [C0603]
C42  CC0603  [C0603]
C43  10 uF  CC0603  [C0603]
C44  4.7 uF  CC0603  [C0603]
C45  3.3 uF  CC0603  [C0603]
C46  CC0603  [C0603]
C47  CC0603  [C0603]
C48  CC0603  [C0603]
C49  CC0603  [C0603]
C50  CC0603  [C0603]
C51  CC0603  [C0603]
C52  CC0603  [C0603]
C53  CC0603  [C0603]
C54  CC0603  [C0603]
C55  CC0603  [C0603]
C56  CC0603  [C0603]
C57  CC0603  [C0603]
C58  CC0603  [C0603]
C59  CC0603  [C0603]
C60  CC0603  [C0603]
J1  DCJ0202  [DCJ0202]
L3  RR0603  [R0603]
L4  RR0603  [R0603]
L5  RR0603  [R0603]
L6  RR0603  [R0603]
R13  RR0603  [R0603]
R14  RR0603  [R0603]
R18  RR0603  [R0603]
R19  RR0603  [R0603]
R20  500  RR0603  [R0603]
R21  RR0603  [R0603]
R22  RR0603  [R0603]
R23  RR0603  [R0603]
R24  RR0603  [R0603]
R25  RR0603  [R0603]
R26  RR0603  [R0603]
R27  RR0603  [R0603]
R28  RR0603  [R0603]
R29  85  RR0603  [R0603]
R30  RR0603  [R0603]
R31  RR0603  [R0603]
R32  RR0603  [R0603]
R33  RR0603  [R0603]
R34  RR0603  [R0603]
R35  RR0603  [R0603]
U$10  TPS65400RGZR  [VQFN48]

### Nets
ENSW3: R35.2 U$10.27(ENSW3)
ENSW4: R33.2 U$10.34(ENSW4)
GND: C35.2 C36.2 C38.2 C40.1 C41.1 C42.1 C43.1 C44.1 C45.1 C46.1 C47.1 C48.1 C51.2 C52.2 C53.2 C54.2 C55.2 C56.2 C60.2 J1.3 R18.1 R22.1 R26.2 R29.2 R31.2 R34.2 U$10.7(PGND) U$10.8(PGND) U$10.21(AGND) ; also sheet 1,3
N$21: C33.2 U$10.1(CB1)
N$28: C33.1 L3.2 U$10.3(SW1)
N$32: J1.2
N$38: C34.1 L4.2 U$10.10(SW2)
N$39: C34.2 U$10.12(CB2)
N$40: C37.1 L5.2 U$10.29(SW3)
N$41: C37.2 U$10.28(CB3)
N$42: R13.2 U$10.13(ENSW2)
N$43: C39.2 R14.1 R18.2 U$10.14(VFB2)
N$44: C40.2 R19.1
N$45: R20.2 U$10.17(PGOOD)
N$46: C41.2 R19.2 U$10.15(COMP2)
N$54: C43.2 U$10.18(VDDG)
N$57: C44.2 U$10.19(VDDA)
N$58: C46.2 U$10.24(SS3/PG3)
N$59: C42.2 U$10.16(SS2/PG2)
N$60: C48.2 R21.1
N$64: C49.2 R22.2 R23.2 U$10.26(VFB3)
N$65: C47.2 R21.2 U$10.25(COMP3)
N$67: R24.1 U$10.48(ENSW1/ENSEQ)
N$68: C51.1 R27.2
N$73: R29.1 U$10.38(I2CADDR)
N$74: C57.1 R31.1 R32.2 U$10.35(VFB4)
N$75: C58.1 L6.2 U$10.32(SW4)
N$76: C50.2 R25.1 R26.1 U$10.47(VFB1)
N$77: C56.1 R30.2
N$78: C52.1 R27.1 U$10.46(COMP1)
N$79: C53.1 U$10.45(SS1/PG1)
N$80: C54.1 U$10.37(SS4/PG4)
N$81: C55.1 R30.1 U$10.36(COMP4)
N$82: C58.2 U$10.33(CB4)
N$85: R34.1 U$10.40(RCLOCK_SYNC)
RST_N: R28.1 U$10.39(RST_N)
SCL: U$10.43(SCL) ; also sheet 1
SDA: U$10.42(SDA) ; also sheet 1
VCC_1_2: C38.1 C49.1 L5.1 R23.1 ; also sheet 1
VCC_1_8: C36.1 C39.1 L4.1 R14.2 ; also sheet 1,3
VCC_2_5: C57.2 C59.2 L6.1 R32.1 ; also sheet 1
VCC_3_3: C35.1 C50.1 L3.1 R25.2 ; also sheet 1,3
VDDD: C45.2 R13.1 R20.1 R24.2 R28.2 R33.1 R35.1 U$10.20(VDDD)
VIN: C60.1 J1.1 U$10.5(PVIN) U$10.6(PVIN) U$10.22(VIN) U$10.30(PVIN) U$10.31(PVIN)
Unconnected: C59.1 U$10.0(PGND) U$10.23(CE) U$10.41(I2CALERT) U$10.44(CLK_OUT)

## Sheet 3 of 3
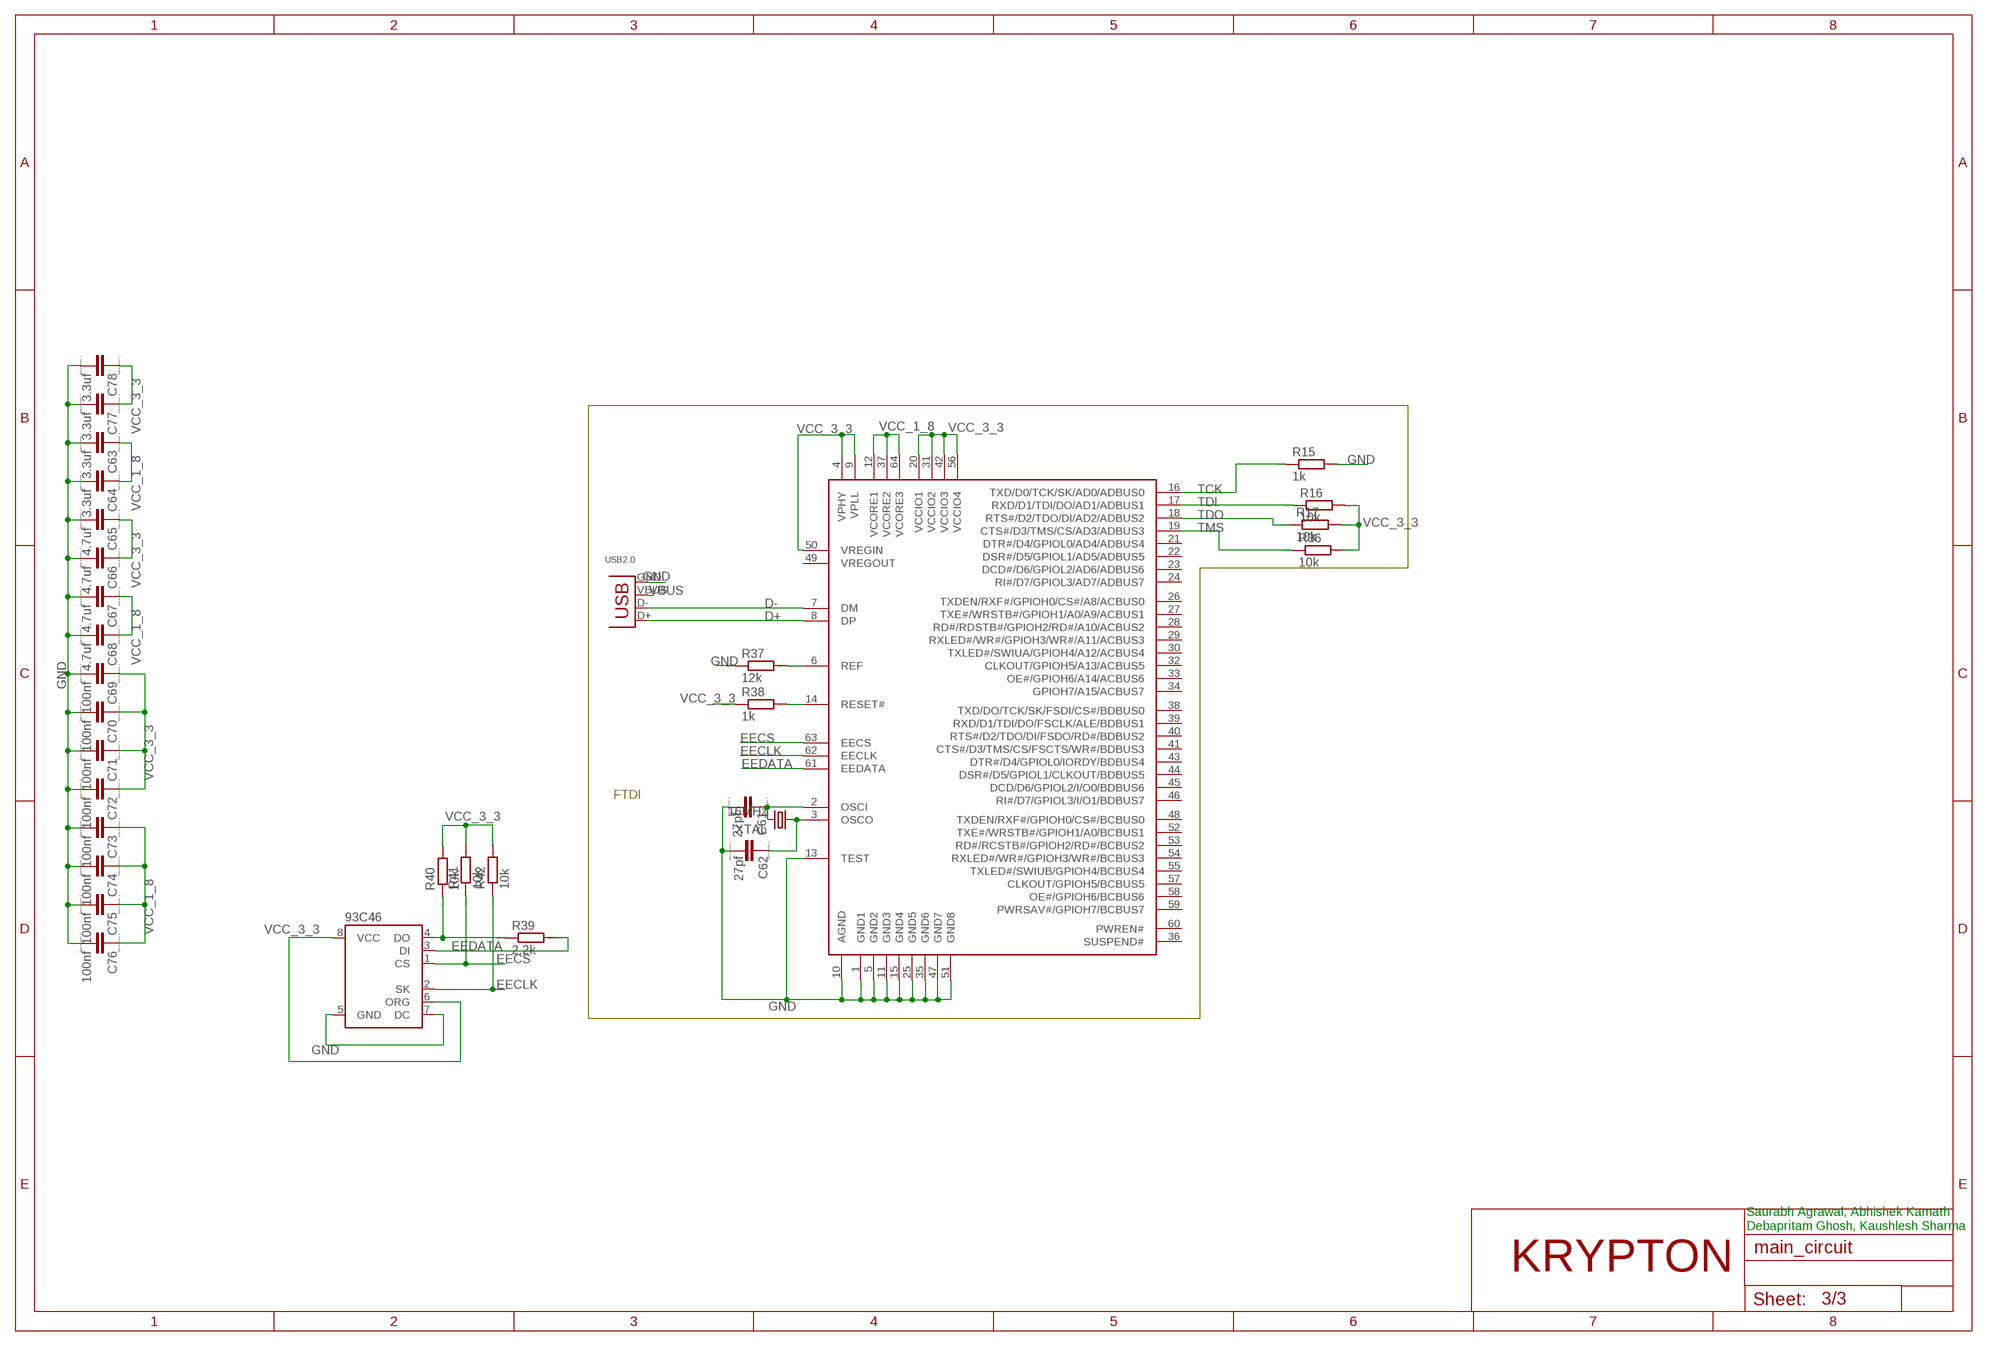
[diagram p4: schematic, sheet 3]

### Parts
93C46  AT93C6  [SOIC8]
C61  27pf  CC0603  [C0603]
C62  27pf  CC0603  [C0603]
C63  3.3uf  CC0603  [C0603]
C64  3.3uf  CC0603  [C0603]
C65  4.7uf  CC0603  [C0603]
C66  4.7uf  CC0603  [C0603]
C67  4.7uf  CC0603  [C0603]
C68  4.7uf  CC0603  [C0603]
C69  100nf  CC0603  [C0603]
C70  100nf  CC0603  [C0603]
C71  100nf  CC0603  [C0603]
C72  100nf  CC0603  [C0603]
C73  100nf  CC0603  [C0603]
C74  100nf  CC0603  [C0603]
C75  100nf  CC0603  [C0603]
C76  100nf  CC0603  [C0603]
C77  3.3uf  CC0603  [C0603]
C78  3.3uf  CC0603  [C0603]
FT2232H  FT2232H  [LQFP_NEW]
R15  1k  RR0603  [R0603]
R16  10k  RR0603  [R0603]
R17  10k  RR0603  [R0603]
R36  10k  RR0603  [R0603]
R37  12k  RR0603  [R0603]
R38  1k  RR0603  [R0603]
R39  2.2k  RR0603  [R0603]
R40  10k  RR0603  [R0603]
R41  10k  RR0603  [R0603]
R42  10k  RR0603  [R0603]
USB2.0  USB-B-H  [USB-B-H]
XTAL  16MHz  CRYSTALHC18U-V  [HC18U-V]

### Nets
D+: FT2232H.8(DP) USB2.0.D+
D-: FT2232H.7(DM) USB2.0.D-
EECLK: 93C46.2(SK) FT2232H.62(EECLK) R42.1
EECS: 93C46.1(CS) FT2232H.63(EECS) R41.1
EEDATA: 93C46.3(DI) FT2232H.61(EEDATA) R39.2
GND: 93C46.5(GND) 93C46.7(DC) C61.2 C62.2 C63.2 C64.2 C65.2 C66.2 C67.2 C68.2 C69.2 C70.2 C71.2 C72.2 C73.2 C74.2 C75.2 C76.2 C77.2 C78.2 FT2232H.1(GND1) FT2232H.5(GND2) FT2232H.10(AGND) FT2232H.11(GND3) FT2232H.13(TEST) FT2232H.15(GND4) FT2232H.25(GND5) FT2232H.35(GND6) FT2232H.47(GND7) FT2232H.51(GND8) R15.2 R37.1 USB2.0.GND ; also sheet 1,2
N$88: FT2232H.6(REF) R37.2
N$89: FT2232H.14(RESET#) R38.2
N$90: 93C46.4(DO) R39.1 R40.1
OSCI: C61.1 FT2232H.2(OSCI) XTAL.2
OSCO: C62.1 FT2232H.3(OSCO) XTAL.1
TCK: FT2232H.16(TXD/D0/TCK/SK/AD0/ADBUS0) R15.1 ; also sheet 1
TDI: FT2232H.17(RXD/D1/TDI/DO/AD1/ADBUS1) R16.1 ; also sheet 1
TDO: FT2232H.18(RTS#/D2/TDO/DI/AD2/ADBUS2) R17.1 ; also sheet 1
TMS: FT2232H.19(CTS#/D3/TMS/CS/AD3/ADBUS3) R36.1 ; also sheet 1
VBUS: USB2.0.VBUS
VCC_1_8: C63.1 C64.1 C67.1 C68.1 C73.1 C74.1 C75.1 C76.1 FT2232H.12(VCORE1) FT2232H.37(VCORE2) FT2232H.64(VCORE3) ; also sheet 1,2
VCC_3_3: 93C46.6(ORG) 93C46.8(VCC) C65.1 C66.1 C69.1 C70.1 C71.1 C72.1 C77.1 C78.1 FT2232H.4(VPHY) FT2232H.9(VPLL) FT2232H.20(VCCIO1) FT2232H.31(VCCIO2) FT2232H.42(VCCIO3) FT2232H.50(VREGIN) FT2232H.56(VCCIO4) R16.2 R17.2 R36.2 R38.1 R40.2 R41.2 R42.2 ; also sheet 1,2
Unconnected: FT2232H.21(DTR#/D4/GPIOL0/AD4/ADBUS4) FT2232H.22(DSR#/D5/GPIOL1/AD5/ADBUS5) FT2232H.23(DCD#/D6/GPIOL2/AD6/ADBUS6) FT2232H.24(RI#/D7/GPIOL3/AD7/ADBUS7) FT2232H.26(TXDEN/RXF#/GPIOH0/CS#/A8/ACBUS0) FT2232H.27(TXE#/WRSTB#/GPIOH1/A0/A9/ACBUS1) FT2232H.28(RD#/RDSTB#/GPIOH2/RD#/A10/ACBUS2) FT2232H.29(RXLED#/WR#/GPIOH3/WR#/A11/ACBUS3) FT2232H.30(TXLED#/SWIUA/GPIOH4/A12/ACBUS4) FT2232H.32(CLKOUT/GPIOH5/A13/ACBUS5) FT2232H.33(OE#/GPIOH6/A14/ACBUS6) FT2232H.34(GPIOH7/A15/ACBUS7) FT2232H.36(SUSPEND#) FT2232H.38(TXD/DO/TCK/SK/FSDI/CS#/BDBUS0) FT2232H.39(RXD/D1/TDI/DO/FSCLK/ALE/BDBUS1) FT2232H.40(RTS#/D2/TDO/DI/FSDO/RD#/BDBUS2) FT2232H.41(CTS#/D3/TMS/CS/FSCTS/WR#/BDBUS3) FT2232H.43(DTR#/D4/GPIOL0/IORDY/BDBUS4) FT2232H.44(DSR#/D5/GPIOL1/CLKOUT/BDBUS5) FT2232H.45(DCD/D6/GPIOL2/I/O0/BDBUS6) FT2232H.46(RI#/D7/GPIOL3/I/O1/BDBUS7) FT2232H.48(TXDEN/RXF#/GPIOH0/CS#/BCBUS0) FT2232H.49(VREGOUT) FT2232H.52(TXE#/WRSTB#/GPIOH1/A0/BCBUS1) FT2232H.53(RD#/RCSTB#/GPIOH2/RD#/BCBUS2) FT2232H.54(RXLED#/WR#/GPIOH3/WR#/BCBUS3) FT2232H.55(TXLED#/SWIUB/GPIOH4/BCBUS4) FT2232H.57(CLKOUT/GPIOH5/BCBUS5) FT2232H.58(OE#/GPIOH6/BCBUS6) FT2232H.59(PWRSAV#/GPIOH7/BCBUS7) FT2232H.60(PWREN#)

### Notes on the sheet
- FTDI
- Saurabh Agrawal, Abhishek Kamath
- Debapritam Ghosh, Kaushlesh Sharma
- KRYPTON

## Power pins joined to a net without a drawn wire
IO104: IC1.104(IO104)

## Library data of the parts
93C46 = atmel:AT93C*6: 3-wire serial EEPROM
C1-C7 C9-C11 C13-C25 C27 C28 C30-C80 = eagle-ltspice:C: CAPACITOR, European symbol; SPICEMODEL: NONE; SPICEPREFIX: C
C8 C12 C26 C29 = resistor:CPOL-US: POLARIZED CAPACITOR, American symbol
E_R1 L1-L6 R1-R45 = eagle-ltspice:R: RESISTOR, European symbol; SPICEMODEL: NONE; SPICEPREFIX: R
FT2232H = ft2232h_lqfp64:FT2232H: FT2232H Dual High Speed USB to Multipurpose UART/FIFO IC
GND U$8 = fpga-resource-reutil_new:TS3DV642
IC1 = kamal:5M1270Z: EP2C8T144 Auto generated by make-symbol-device-package-bsdl.ulp Rev. 19 Tip: Use split-device-symbol.ulp to generate a Device with multiple small symbols! Read HELP. Source: EP2C8T144.BSD; MPN: EP2C8T144C8N; OC_FARNELL: 1663192; OC_NEWARK: 51R0576
J1 = con-jack:DCJ0202: DC POWER JACK Source: DCJ0202.pdf; OC_FARNELL: unknown; OC_NEWARK: unknown
SV1 SV3 = con-lstb:MA04-1: PIN HEADER; OC_FARNELL: unknown; OC_NEWARK: unknown
SV2 = con-lstb:MA05-2: PIN HEADER; OC_FARNELL: unknown; OC_NEWARK: unknown
U1 = fpga-resource-reutil:ADV7180
U2 = fpga-resource-reutil:ADAU1977WBCPZ
U$1 = memory:SST39VF64
U$2 = kamal:CDCE925
U$3 = fpga-resource-reutil:CP2200; PARTDESC: MCU, SINGLE CHIP ETHERNET CONTROLLER, QFP48, RoHS.; PARTNUMBER: CP2200; QUANTITY_AVAILABLE: 0; VENDOR: Silicon Labs
U$4 = fpga-resource-reutil:SODIMM
U$5 = fpga-resource-reutil:TPD4E1B06: Bidirectional Quad Channel High Speed ESD Protection Device 6-SC70 -40 to 125
U$6 = magjacksmalldrill:MAGJACK
U$9 = SparkFun-Connectors:AV3RCA
U$10 = ti-power:TPS65400: Quad 4A/4A/2A/2A buck converter
USB2.0 = con-usb-3:USB: USB Connectors
XTAL = crystal:CRYSTAL: CRYSTAL; OC_FARNELL: unknown; OC_NEWARK: unknown
Y1-Y3 = abracon:CRYSTAL